# EAGLE design NDVI_pcb (EAGLE 9.6.2)
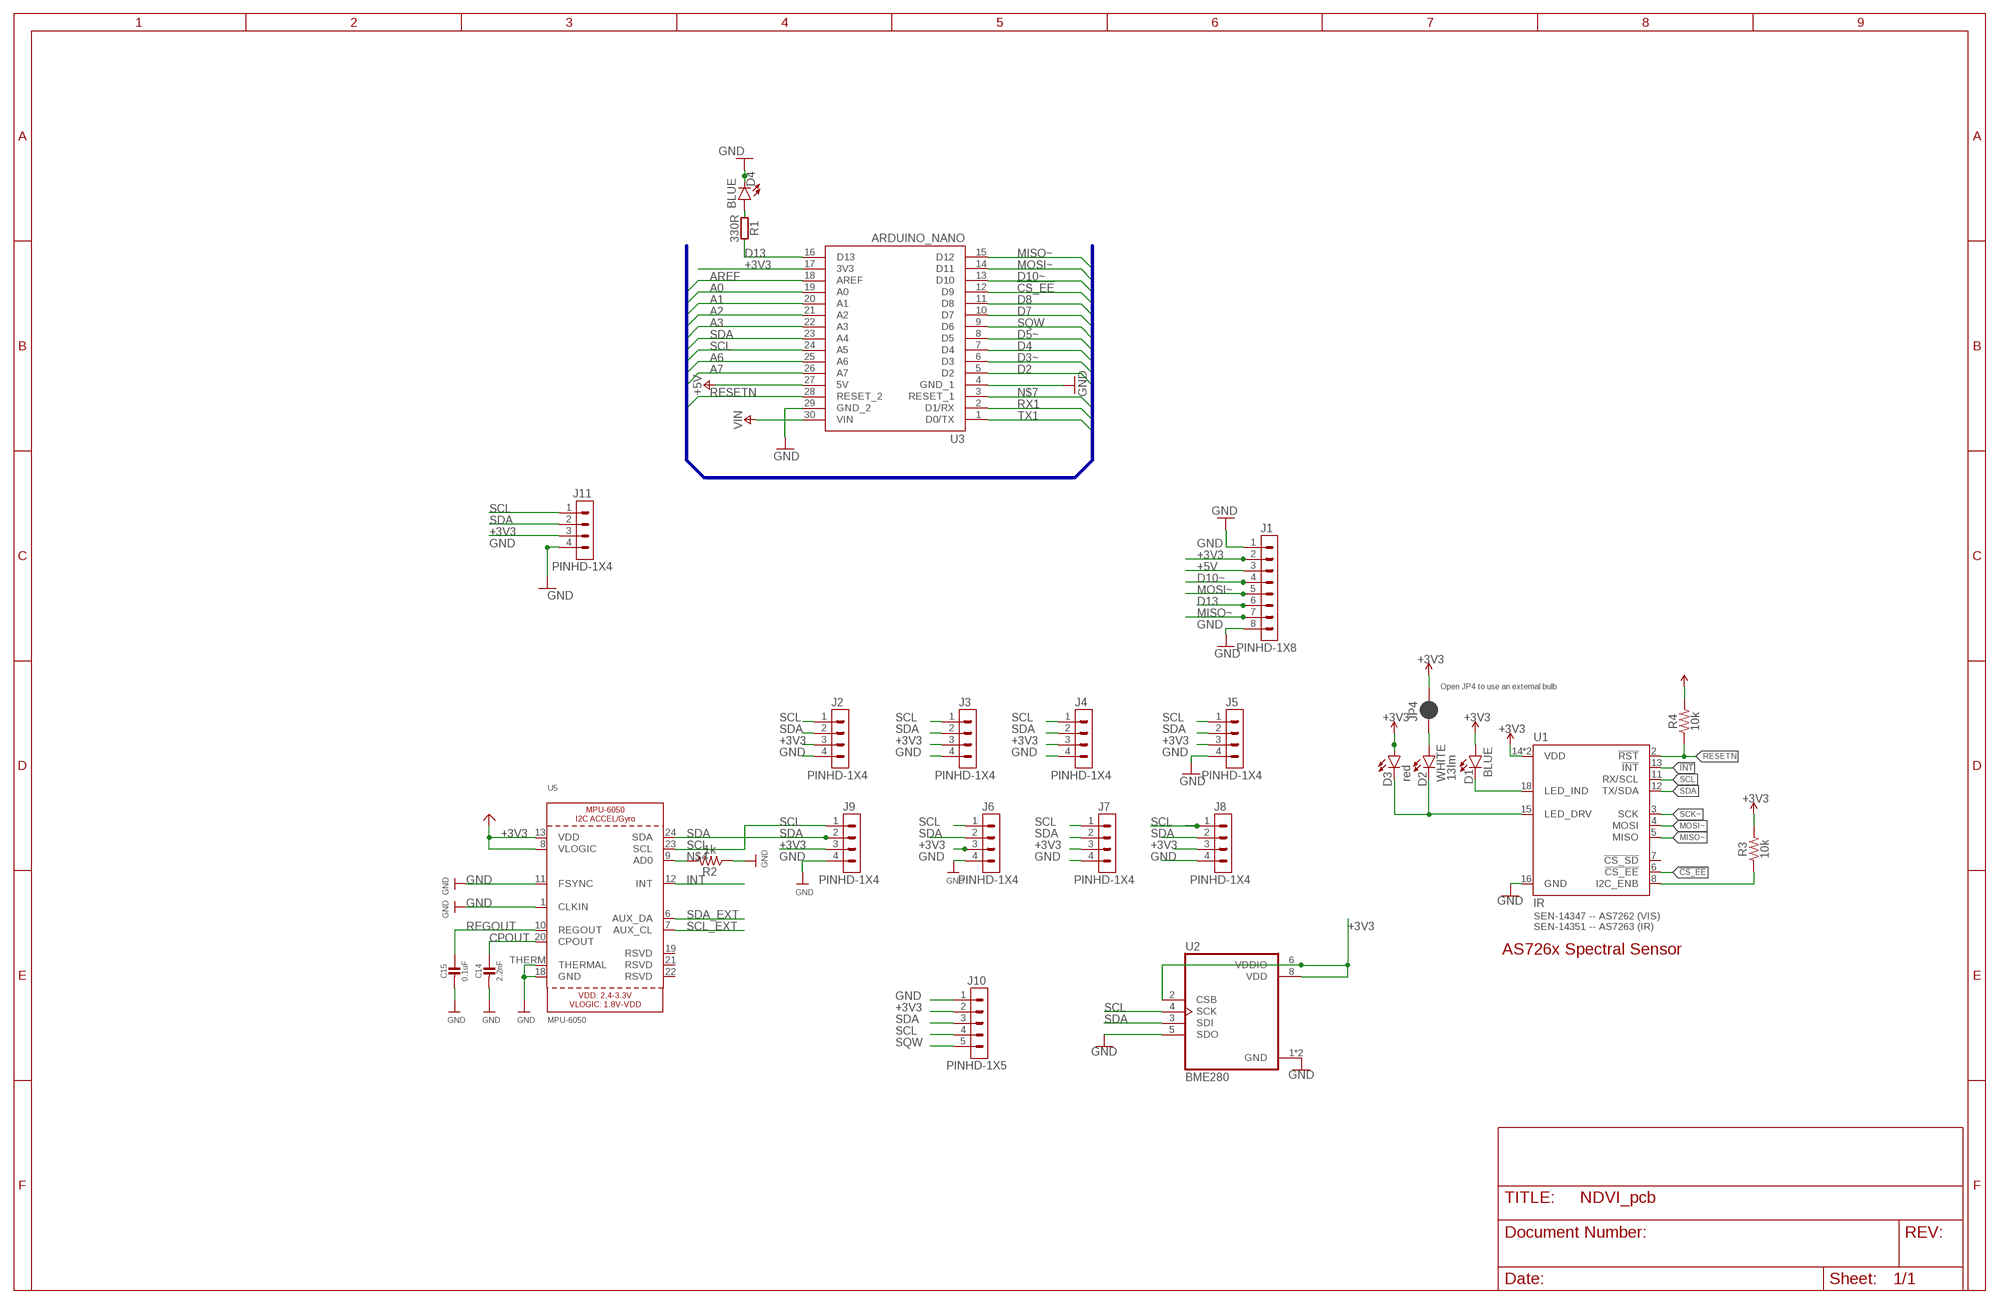
[diagram p0: schematic, sheet 1]

## Parts
C14  2.2nF  CAP_CERAMIC0603_NO  [0603-NO]
C15  0.1uF  CAP_CERAMIC0603_NO  [0603-NO]
D1  BLUE  LED-BLUE0603  [LED-0603]
D2  WHITE  LED-WHITE0603  [LED-0603]
D3  red  LED-WHITE0603  [LED-0603]
D4  BLUE  LED-BLUE0603  [LED-0603]
J1  PINHD-1X8  [1X08]
J2  PINHD-1X4  [1X04]
J3  PINHD-1X4  [1X04]
J4  PINHD-1X4  [1X04]
J5  PINHD-1X4  [1X04]
J6  PINHD-1X4  [1X04]
J7  PINHD-1X4  [1X04]
J8  PINHD-1X4  [1X04]
J9  PINHD-1X4  [1X04]
J10  PINHD-1X5  [1X05]
J11  PINHD-1X4  [1X04]
JP4  JUMPER-SMT_2_NC_PASTE_NO-SILK  [SMT-JUMPER_2_NC_PASTE_NO-SILK]
R1  330R  R-330R-0603  [C0603]
R2  1k  10KOHM-0603-1/10W-1%  [0603]
R3  10k  10KOHM-0603-1/10W-1%  [0603]
R4  10k  10KOHM-0603-1/10W-1%  [0603]
U1  IR  AS726XIR  [LGA20]
U2  BME280  [PSON65P250X250X100-8N]
U3  ARDUINO_NANO  ARDUINO_NANO_|_A000005  [MODULE_ARDUINO_NANO_|_A000005]
U5  MPU-6050  [QFN24_4MM_SMSC]

## Nets
!CS_EE: U1.6(!CS_EE) U3.12(D9)
!INT: U1.13(!INT)
+3V3: D1.A D3.A J1.2 J2.3 J3.3 J4.3 J5.3 J6.3 J7.3 J8.3 J9.3 J10.2 J11.3 JP4.2 R3.2 R4.2 U1.14(VDD) U1.17(VDD) U2.2(CSB) U2.6(VDDIO) U2.8(VDD) U3.17(3V3) U5.8(VLOGIC) U5.13(VDD) ; supply symbol labelled 3.3V
+5V: J1.3 U3.27(5V)
A0: U3.19(A0)
A1: U3.20(A1)
A2: U3.21(A2)
A3: U3.22(A3)
A6: U3.25(A6)
A7: U3.26(A7)
AREF: U3.18(AREF)
CPOUT: C14.1 U5.20(CPOUT)
D2: U3.5(D2)
D3~: U3.6(D3)
D4: U3.7(D4)
D5~: U3.8(D5)
D7: U3.10(D7)
D8: U3.11(D8)
D10~: J1.4 U3.13(D10)
D13: J1.6 R1.2 U3.16(D13)
GND: C14.2 C15.2 D4.C J1.1 J1.8 J2.4 J3.4 J4.4 J5.4 J6.4 J7.4 J8.4 J9.4 J10.1 J11.4 R2.1 U1.16(GND) U2.1(GND) U2.5(SDO) U2.7(GND) U3.29(GND_2) U5.1(CLKIN) U5.11(FSYNC) U5.18(GND) U5.THERM(THERMAL)
INT: U5.12(INT)
LED_DRV: D2.C D3.C U1.15(LED_DRV)
MISO~: J1.7 U1.5(MISO) U3.15(D12)
MOSI~: J1.5 U1.4(MOSI) U3.14(D11)
N$1: R3.1 U1.8(I2C_ENB)
N$2: D1.C U1.18(LED_IND)
N$3: D4.A R1.1
N$4: R2.2 U5.9(AD0)
N$5: U3.4(GND_1) ; supply symbol labelled GND
N$6: D2.A JP4.1
N$7: U3.3(RESET_1)
REGOUT: C15.1 U5.10(REGOUT)
RESETN: R4.1 U1.2(!RST) U3.28(RESET_2)
RX1: U3.2(D1/RX)
SCK~: U1.3(SCK)
SCL: J2.1 J3.1 J4.1 J5.1 J6.1 J7.1 J8.1 J9.1 J10.4 J11.1 U1.11(RX/SCL) U2.4(SCK) U3.24(A5) U5.23(SCL)
SCL_EXT: U5.7(AUX_CL)
SDA: J2.2 J3.2 J4.2 J5.2 J6.2 J7.2 J8.2 J9.2 J10.3 J11.2 U1.12(TX/SDA) U2.3(SDI) U3.23(A4) U5.24(SDA)
SDA_EXT: U5.6(AUX_DA)
SQW: J10.5 U3.9(D6)
TX1: U3.1(D0/TX)
VIN: U3.30(VIN)
Unconnected: U1.7(!CS_SD) U5.19(RSVD) U5.21(RSVD) U5.22(RSVD)

## Buses
A0,A1,A2,A3,A4/SDA,A5/SCL,A6,A7,AREF,D2,D3~,D4,D5~,D6~,D7,D8,D9~,D10~,MISO,MOSI,RESETN,RX0,RX1,SCK~,SCL,SDA,TX1,UPDI,VIN

## Notes on the sheet
- Open JP4 to use an external bulb
- 13lm
- SEN-14347 -- AS7262 (VIS)
  SEN-14351 -- AS7263 (IR)
- AS726x Spectral Sensor

## Library data of the parts
C14 C15 = microbuilder:CAP_CERAMIC: Ceramic Capacitors For new designs, use the packages preceded by an '_' character since they are more reliable: The following footprints should be used on most boards: _0402 - Standard footprint for regular board layouts _0603 - Standard footprint for regular board layouts _0805 - Standard footprint for regular board layouts _1206 - Standard footprint for regular board layouts For extremely tight-pitch boards where space is at a premium, the following 'micro-pitch' footprints can be used (smaller pads, no silkscreen outline, etc.): _0402MP - Micro-pitch footprint for very dense/compact boards _0603MP - Micro-pitch footprint for very dense/compact boards _0805MP - Micro-pitch footprint for very dense/compact boards _1206MP - Micro-pitch footprint for very dense/compact boards
D1 D4 = SparkFun-LED:LED-BLUE: Blue SMD LED Used in manufacturing of various products at SparkFun Packages: 0603 - SMD 0603 package [Product Link] <http://www.digikey.com/product-detail/en/SMLE12BC7TT86/511-1589-2-ND/1641808> 1206 - SMD1206 package [Product Link] <http://www.digikey.com/product-detail/en/lite-on-inc/LTST-C150TBKT/160-1643-1-ND/573584> SparkFun Products: ESP8266 Thing-Dev Board <https://www.sparkfun.com/products/13711> RedBoard <https://www.sparkfun.com/products/12757>; PROD_ID: DIO-08575
D2 = SparkFun-LED:LED-WHITE: White SMD LED Used in manufacturing several products at SparkFun. Packages: 0603 - Bright White SMD 0603 package[Product Link] <http://www.kingbrightusa.com/product.asp?catalog_name=LED&product_id=APT1608QWF/D> 1206 - Bright White SMD1206 package [Product Link] <http://www.kingbrightusa.com/product.asp?catalog_name=LED&product_id=APT3216QWF/D> 3014 - Super Bright SMD 3014 package [Datasheet] <http://www.lumileds.com/uploads/459/DS208-pdf> SparkFun Products: Blackberry Trackballer Breakout <https://www.sparkfun.com/products/13169> Digital SandBox <https://www.sparkfun.com/products/12651>; PROD_ID: DIO-09004
D3 = SparkFun-LED:LED-WHITE: White SMD LED Used in manufacturing several products at SparkFun. Packages: 0603 - Bright White SMD 0603 package[Product Link] <http://www.kingbrightusa.com/product.asp?catalog_name=LED&product_id=APT1608QWF/D> 1206 - Bright White SMD1206 package [Product Link] <http://www.kingbrightusa.com/product.asp?catalog_name=LED&product_id=APT3216QWF/D> 3014 - Super Bright SMD 3014 package [Datasheet] <http://www.lumileds.com/uploads/459/DS208-pdf> SparkFun Products: Blackberry Trackballer Breakout <https://www.sparkfun.com/products/13169> Digital SandBox <https://www.sparkfun.com/products/12651>; PROD_ID: DIO-09004; VALUE: WHITE
J1 = Connector:PINHD-1X8: Pin Header; CATEGORY: Connectors; DESCRIPTION: Header-Straight-8 Position; PACKAGE_TYPE: Through Hole; PITCH: 0.100" (2.54mm); SUBCATEGORY: Headers; TYPE: Male Pins
J2-J9 J11 = Connector:PINHD-1X4: Pin Header; CATEGORY: Connectors; DESCRIPTION: Header-Straight-4 Position; PACKAGE_TYPE: Through Hole; PITCH: 0.100" (2.54mm); SUBCATEGORY: Headers; TYPE: Male Pins
J10 = Connector:PINHD-1X5: Pin Header; CATEGORY: Connectors; DESCRIPTION: Header-Straight-5 Position; PACKAGE_TYPE: Through Hole; PITCH: 0.100" (2.54mm); SUBCATEGORY: Headers; TYPE: Male Pins
JP4 = SparkFun-Jumpers:JUMPER-SMT_2_NC_PASTE: Normally closed solder jumper This jumper has an aperture in the stencil to allow solder paste to bridge the split in the wire so it's normally closed (NC). Wick off the solder to open the connection. Reapply solder to reclose the connection.
R1 = Arduino-rcl:R: SMD Resistor; CODE-ARDUINO: 0049; DATASHEET: http://www.yageo.com/documents/recent/PYu-RC_Group_51_RoHS_L_10.pdf; DISTRIBUTOR-LINK: https://www.digikey.com/product-detail/en/yageo/RC0603FR-07330RL/311-330HRCT-ND/730109; DISTRIBUTOR-PN: 311-330HRCT-ND; MANUFACTURER: Yageo; MANUFACTURER-PN: RC0603FR-07330RL; NOTE: NO; PN-ALTERNATIVE1: -
R2 = SparkFun-Resistors:10KOHM: 10kΩ resistor A resistor is a passive two-terminal electrical component that implements electrical resistance as a circuit element. Resistors act to reduce current flow, and, at the same time, act to lower voltage levels within circuits. - Wikipedia; PROD_ID: RES-00824; VALUE: 10k
R3 R4 = SparkFun-Resistors:10KOHM: 10kΩ resistor A resistor is a passive two-terminal electrical component that implements electrical resistance as a circuit element. Resistors act to reduce current flow, and, at the same time, act to lower voltage levels within circuits. - Wikipedia; PROD_ID: RES-00824
U1 = SparkFun-Sensors:AS726X; PROD_ID: IC-13731
U2 = BME280:BME280: Check availability <https://pricing.snapeda.com/parts/BME280/Bosch/view-part?ref=eda>; AVAILABILITY: In Stock; CHECK_PRICES: https://www.snapeda.com/parts/BME280/Bosch/view-part/?ref=eda; DESCRIPTION: Board Mount Humidity Sensors MEMS humidity, pressure and temperature sensor; MF: Bosch; MP: BME280; PACKAGE: LGA-8 Bosch; PRICE: None; SNAPEDA_LINK: https://www.snapeda.com/parts/BME280/Bosch/view-part/?ref=snap
U3 = ARDUINO_NANO___A000005:ARDUINO_NANO_|_A000005: CLOCK SAW OSCILLATOR SEAM7050 T& Check availability <https://pricing.snapeda.com/parts/ARDUINO%20NANO%20%7C%20A000005/Arduino/view-part?ref=eda>; AVAILABILITY: Not in stock; CHECK_PRICES: https://www.snapeda.com/parts/ARDUINO%20NANO%20%7C%20A000005/Arduino/view-part/?ref=eda; DESCRIPTION: ATSAMD21G18A Arduino Nano 33 IoT series ARM® Cortex®-M0+ MCU 32-Bit Embedded Evaluation Board; MF: Arduino; MP: ARDUINO NANO | A000005; PACKAGE: Non-Standard Arduino; PRICE: None; PURCHASE-URL: https://www.snapeda.com/api/url_track_click_mouser/?unipart_id=7183667&manufacturer=Arduino&part_name=ARDUINO NANO | A000005&search_term=arduino nano; SNAPEDA_LINK: https://www.snapeda.com/parts/ARDUINO%20NANO%20%7C%20A000005/Arduino/view-part/?ref=snap
U5 = microbuilder:MPU-6050: MPU-6050 3-Axis Accelerometer/Gyroscope

## Net classes
1 highpower: width 0.406 mm, drill 0.483 mm

## Board
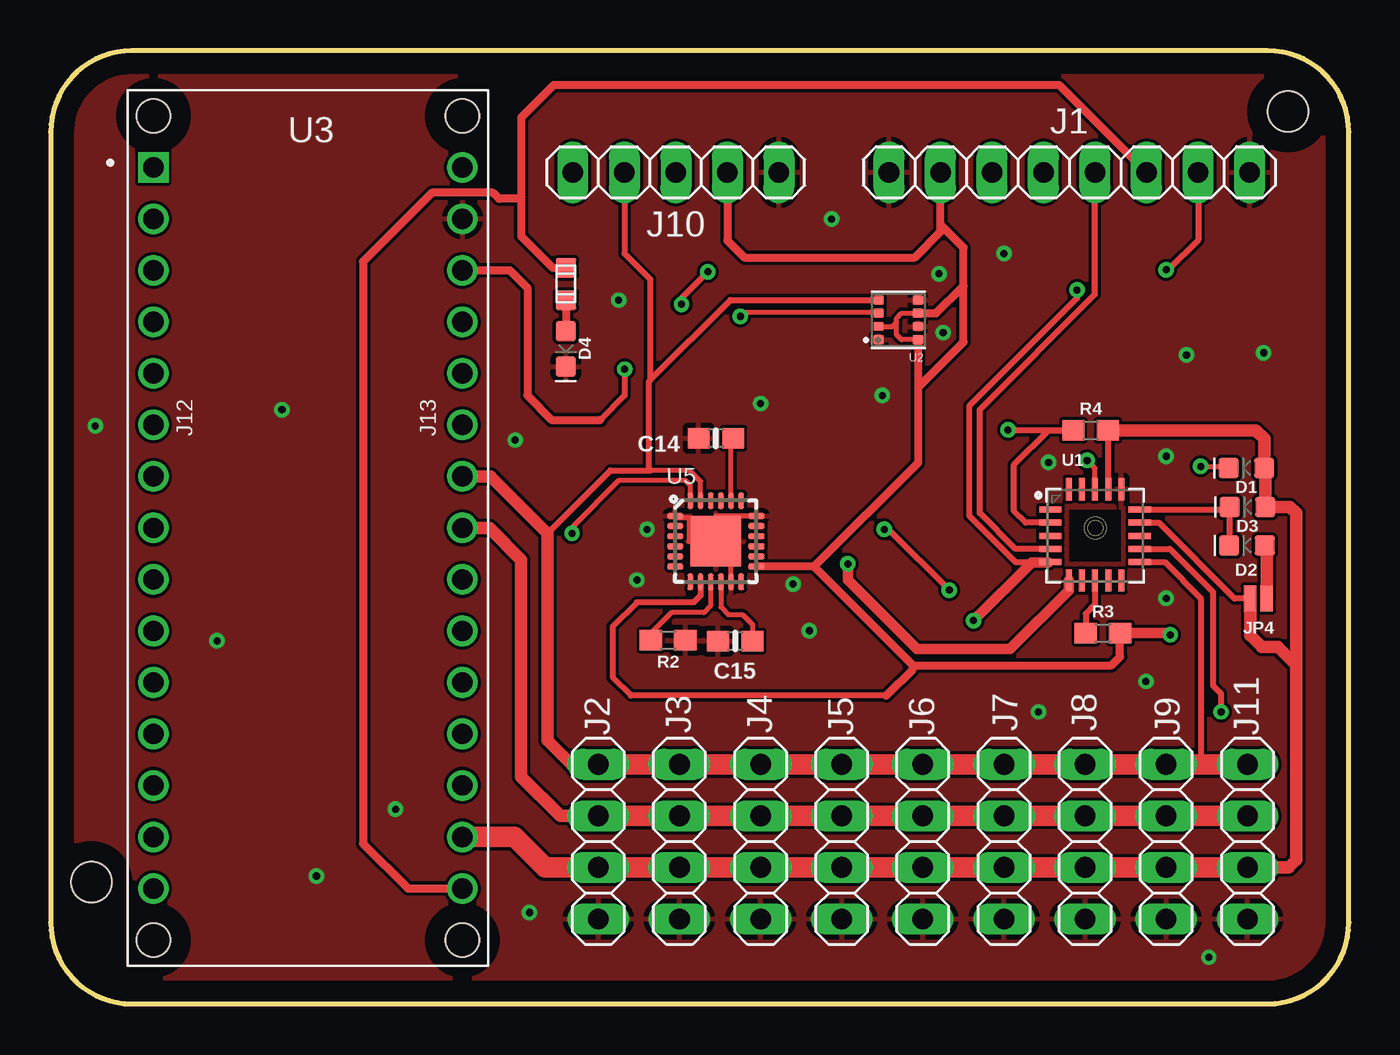
[diagram p1: board, top side]
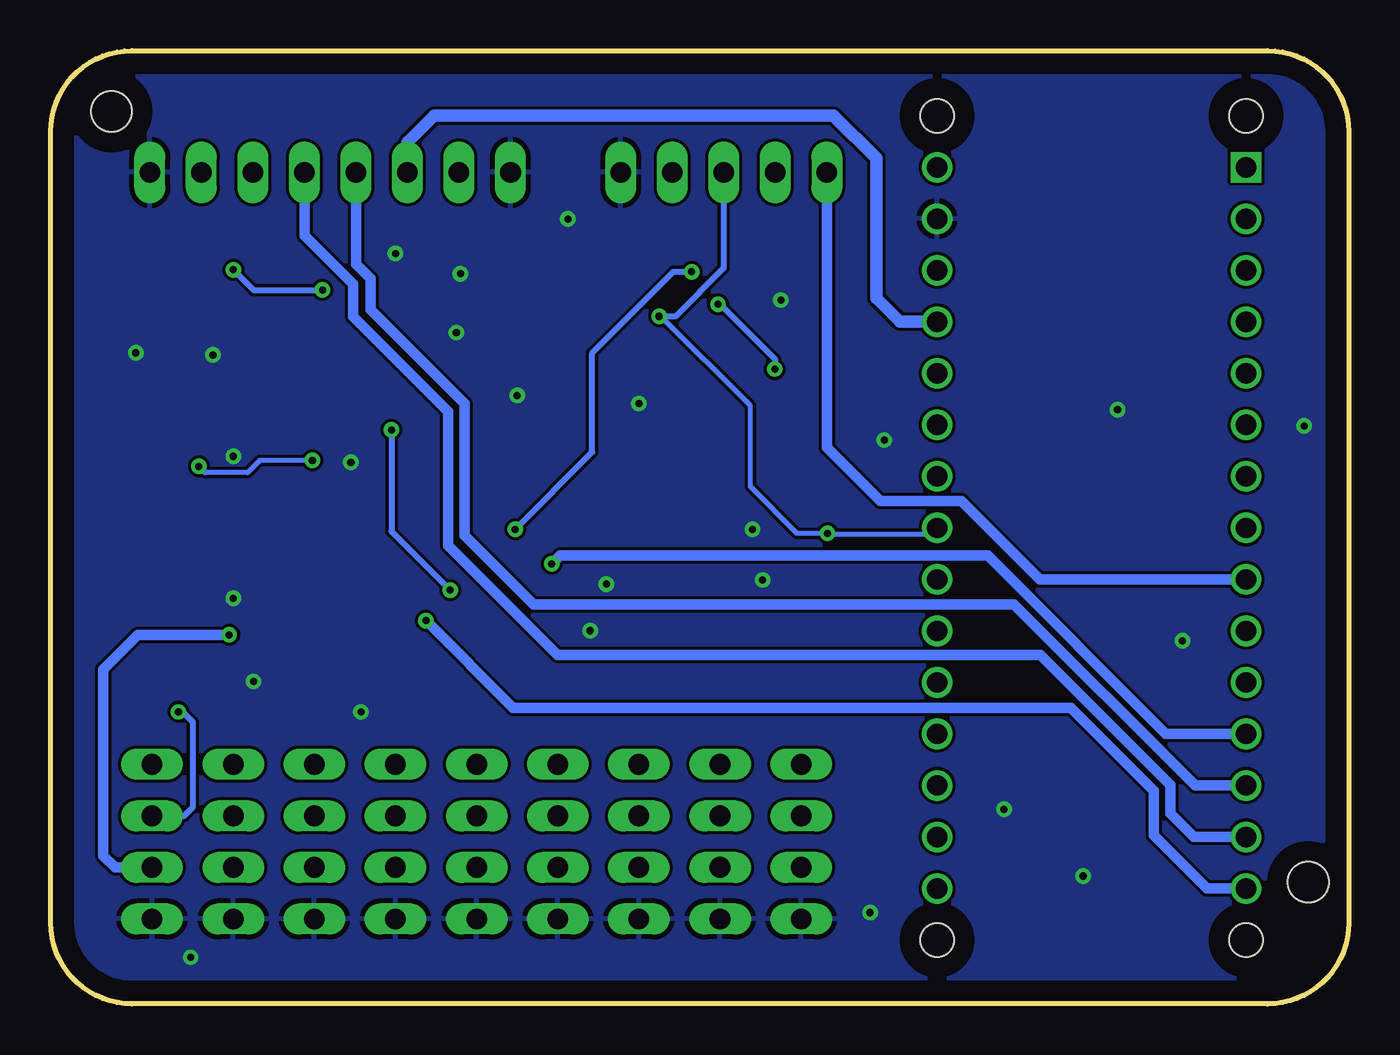
[diagram p2: board, bottom side, seen from below]

Size 64 x 47 mm. Coordinates in mm from the lower left corner, seen from the top.
Outline: 0,4 arc90 4,0 60,0 arc90 64,4 64,43 arc90 60,47 4,47 arc90 0,43 0,4
Copper layers (1*16): Top 0.035mm / dielectric 1.5mm / Bottom 0.035mm
Design rules "default": minimum track width 6mil, minimum drill 0.35mm, track to track 6mil, track to pad 6mil, pad to pad 6mil, via to via 6mil, smd to smd 6mil, copper to edge 40mil, drill to drill 6mil, minimum pad ring 10mil, minimum via ring 8mil, stop-mask expansion 4mil, vias tented up to drill 0mil, thermal gap 10mil
Holes 2 mm at 2,6 61,44

### Footprints (pad centres in the part's own frame; a part is rotated, then mirrored left to right if it is on the bottom)
0603-NO = smd 1.075 x 1: 1 -0.85,0; 2 0.85,0
LED-0603 = smd 1 x 1: A -0.877,0; C 0.877,0
1X08 = drill 1.016 long: 1 -8.89,0; 2 -6.35,0; 3 -3.81,0; 4 -1.27,0; 5 1.27,0; 6 3.81,0; 7 6.35,0; 8 8.89,0
1X04 = drill 1.016 long: 1 -3.81,0; 2 -1.27,0; 3 1.27,0; 4 3.81,0
1X05 = drill 1.016 long: 1 -5.08,0; 2 -2.54,0; 3 0,0; 4 2.54,0; 5 5.08,0
SMT-JUMPER_2_NC_PASTE_NO-SILK = smd 0.635 x 1.27: 1 -0.406,0; 2 0.406,0
C0603 = smd 0.95 x 1: 1 -0.8,0; 2 0.8,0
0603 = smd 1.1 x 1: 1 -0.85,0; 2 0.85,0
LGA20 = smd 1.1 x 0.3: 1 -2.2,1.3; 2 -2.2,0.65; 3 -2.2,0; 4 -2.2,-0.65; 5 -2.2,-1.3; 11 2.2,-1.3; 12 2.2,-0.65; 13 2.2,0; 14 2.2,0.65; 15 2.2,1.3 | smd 0.3 x 1.1: 6 -1.3,-2.2; 7 -0.65,-2.2; 8 0,-2.2; 9 0.65,-2.2; 10 1.3,-2.2; 16 1.3,2.3; 17 0.65,2.3; 18 0,2.3; 19 -0.65,2.3; 20 -1.3,2.3
PSON65P250X250X100-8N = smd 0.49 x 0.45: 1 0.97,0.975; 2 0.97,0.325; 3 0.97,-0.325; 4 0.97,-0.975; 5 -0.97,-0.975; 6 -0.97,-0.325; 7 -0.97,0.325; 8 -0.97,0.975
MODULE_ARDUINO_NANO_|_A000005 = drill 1 square: 1 -7.62,17.78 | drill 1: 2 -7.62,15.24; 3 -7.62,12.7; 4 -7.62,10.16; 5 -7.62,7.62; 6 -7.62,5.08; 7 -7.62,2.54; 8 -7.62,0; 9 -7.62,-2.54; 10 -7.62,-5.08; 11 -7.62,-7.62; 12 -7.62,-10.16; 13 -7.62,-12.7; 14 -7.62,-15.24; 15 -7.62,-17.78; 16 7.62,-17.78; 17 7.62,-15.24; 18 7.62,-12.7; 19 7.62,-10.16; 20 7.62,-7.62; 21 7.62,-5.08; 22 7.62,-2.54; 23 7.62,0; 24 7.62,2.54; 25 7.62,5.08; 26 7.62,7.62; 27 7.62,10.16; 28 7.62,12.7; 29 7.62,15.24; 30 7.62,17.78 | hole 1.651: -7.62,-20.32; 7.62,-20.32; -7.62,20.32; 7.62,20.32
QFN24_4MM_SMSC = smd 0.8 x 0.28: 1 -2,1.25; 2 -2,0.75; 3 -2,0.25; 4 -2,-0.25; 5 -2,-0.75; 6 -2,-1.25; 13 2,-1.25; 14 2,-0.75; 15 2,-0.25; 16 2,0.25; 17 2,0.75; 18 2,1.25 | smd 0.28 x 0.8: 7 -1.25,-2; 8 -0.75,-2; 9 -0.25,-2; 10 0.25,-2; 11 0.75,-2; 12 1.25,-2; 19 1.25,2; 20 0.75,2; 21 0.25,2; 22 -0.25,2; 23 -0.75,2; 24 -1.25,2 | smd 2.5 x 2.5: THERM 0,0

### Placement (x,y rotation side)
C14  32.8,27.89 180 top
C15  33.75,17.89 180 top
D1  58.95,26.42 180 top
D2  58.98,22.6 180 top
D3  59,24.5 180 top
D4  25.4,32.3 270 top
J1  50.22,41 0 top
J2  27,8 270 top
J3  31,8 270 top
J4  35,8 270 top
J5  39,8 270 top
J6  43,8 270 top
J7  47,8 270 top
J8  51,8 270 top
J9  55,8 270 top
J10  30.82,41 180 top
J11  59,8 270 top
JP4  59.54,19.99 180 top
R1  25.4,35.5 90 top
R2  30.44,17.93 180 top
R3  51.88,18.28 0 top
R4  51.27,28.28 0 top
U1  51.49,23.08 0 top
U2  41.79,33.73 180 top
U3  12.68,23.47 0 top
U5  32.79,22.81 0 top

### Tracks (layer width: path | path; a pad name or v marks a point on that pad's centre or on a via)
!CS_EE  (via drill 0.35)
  Top 0.508: v39.3,21.7 39.3,20.9 42.7,17.5 47.3,17.5 50.19,20.39 U1.6
  Bottom 0.508: U3.12 9.01,13.31 17.8,22.1 38.9,22.1 v39.3,21.7
+3V3  (via drill 0.35)
  Top 0.254: U2.2 41.51,33.41 41.7,33.6 | 41.7,33.6 41.7,33.8 41.95,34.05 U2.6 | U2.8 41.95,32.76 41.7,33 41.7,33.6
  Top 0.305: U1.14 54.63,23.73 58.37,19.99 JP4.2 | U1.17 52.14,28.26 R4.2 | 52.3,16.7 52.7,17.1 52.73,17.13 R3.2 | U5.8 32.04,20.14 31.7,19.8 28.9,19.8 27.7,18.6 27.7,16.1 28.6,15.2 41.2,15.2 | 42.5,16.7 42.5,16.6
  Top 0.406: U2.6 43.66,34.05 45,35.4 | 45,35.4 45,37.3 43.87,38.43 J1.2 43.87,38.07 42.6,36.8 34.2,36.8 33.36,37.64 J10.2 | U2.8 42.76,30.4 | 42.76,30.4 42.76,26.68 37.64,21.56 | 37.64,21.56 U5.13 | 37.64,21.56 42.5,16.7 52.3,16.7 52.73,17.13 | 52.7,17.1 52.7,18.25 R3.2 | 42.5,16.6 42.5,16.5 41.2,15.2 | 42.76,30.4 45,32.64 45,35.4
  Top 0.508: R3.2 55.12,18.28 v55.2,18.2
  Top 0.61: J11.3 61.03,6.73 61.4,7.1 61.4,16.7 | 61.4,16.7 60.5,17.6 59.7,17.6 59.13,18.17 JP4.2 | 61.4,16.7 61.4,24.2 61.1,24.5 D3.A 59.88,26.37 D1.A 59.83,27.87 59.42,28.28 R4.2
  Top 1.016: J11.3 J9.3 J8.3 J7.3 J6.3 J5.3 J4.3 J3.3 J2.3 24.37,6.73 22.87,8.23 U3.17
  Bottom 0.508: v55.2,18.2 59.7,18.2 61.4,16.5 61.4,7.3 60.83,6.73 J11.3
+5V
  Bottom 0.61: U3.27 22.13,33.63 23.3,34.8 23.3,41.7 25.4,43.8 45.1,43.8 46.41,42.49 J1.3
CPOUT
  Top 0.254: U5.20 33.54,27.78 C14.1
D10~
  Bottom 0.508: U3.13 7.57,10.77 16.5,19.7 40.2,19.7 43.6,23.1 43.6,29.6 48.24,34.24 48.24,35.77 48.95,36.48 J1.4
D13
  Top 0.406: J1.6 49.73,45.3 24.8,45.3 23.2,43.7 23.2,39.7 | R1.2 24.75,36.3 23.2,37.85 23.2,39.7 | 23.2,39.7 22.1,39.7 21.8,40 18.8,40 15.4,36.6 15.4,7.9 17.61,5.69 U3.16
GND  (via drill 0.35)
  Top 0.254: U5.11 33.54,22.81 U5.THERM 31.47,22.81 31.47,23.98 30.79,23.98 U5.1 | U5.18 32.8,24.06 32.8,23.2
  other vias: 56,32 41,30 47,37 55,27 55,20 49.2,26.7 59.8,32.1 54,15.9 35,29.6 37.4,18.4 36.6,20.7 28.9,20.9 29.4,23.4 22.9,27.8 28,34.7 38.5,38.7 11.4,29.3 8.2,17.9 2.2,28.5 13.1,6.3 17,9.6 23.6,4.5 57.1,2.3 48.7,14.4 43.8,36 44,33.1
  pour Top: 0,47 64,47 64,0 0,0
  pour Bottom: 0,47 0,0 64,0 64,47
LED_DRV
  Top 0.305: U1.15 58,24.38 D3.C 58.1,24.48 D2.C
MISO~  (via drill 0.35)
  Top 0.305: U1.5 49.2,21.77 47.58,21.77 45.3,24.05 45.3,29.5 50.6,34.8 v50.6,35.2 | J1.7 56.57,37.67 55.1,36.2 v55,36.2
  Top 0.508: v45.5,18.9 48.37,21.77 49.2,21.77
  Bottom 0.305: v55,36.2 54,35.2 v50.6,35.2
  Bottom 0.508: U3.15 6.99,5.69 9.6,8.3 9.6,10.5 13.7,14.6 41.2,14.6 v45.5,18.9
MOSI~
  Top 0.305: U1.4 47.57,22.43 45.8,24.2 45.8,29.3 51.49,34.99 J1.5
  Bottom 0.508: U3.14 7.63,8.23 8.8,9.4 8.8,10.8 15.2,17.2 39,17.2 44.4,22.6 44.4,29.2 49.1,33.9 49.1,35.5 51.49,37.89 J1.5
N$1
  Top 0.305: U1.8 51.49,19.69 51.03,19.23 R3.1
N$2  (via drill 0.35)
  Top 0.254: U1.18 51.49,26.41 v51.1,26.8 | v56.7,26.5 57.99,26.5 D1.C
  Bottom 0.254: v51.1,26.8 53.7,26.8 54.3,26.2 56.4,26.2 v56.7,26.5
N$3
  Top 0.406: R1.1 D4.A
N$4
  Top 0.254: U5.9 32.54,19.64 32.2,19.3 30.6,19.3 29.59,18.29 R2.2
N$6
  Top 0.61: D2.A 59.95,22.51 JP4.1
REGOUT
  Top 0.254: U5.10 33.04,19.56 33.4,19.2 34.1,19.2 34.6,18.7 C15.1
RESETN  (via drill 0.35)
  Top 0.305: U1.2 48.07,23.73 47.5,24.3 47.5,26.6 49.18,28.28 R4.1 47.22,28.28 v47.2,28.3 | v44.3,20.4 41.3,23.4 v41.1,23.4 | v32.4,36.1 30.95,34.65 v31.1,34.5 | v28.3,31.3 28.3,30 27.1,28.8
  Top 0.406: U3.28 22.63,36.17 23.5,35.3 23.5,30 24.7,28.8 27.1,28.8
  Bottom 0.305: v47.2,28.3 47.2,23.3 v44.3,20.4 | v41.1,23.4 37.3,27.2 37.3,32.1 33.3,36.1 v32.4,36.1 | v31.1,34.5 31,34.5 28.3,31.8 v28.3,31.3
SCL
  Top 0.254: U5.23 32.04,25.76 31.5,26.3 29.6,26.3
  Top 0.305: J10.4 28.28,37 29.55,35.73 29.55,30.75 | 24.5,23.2 27.6,26.3 29.5,26.3 | 29.5,26.3 29.6,26.3 | 29.5,26.3 29.5,30.7 29.55,30.75 | 29.55,30.75 33.51,34.7 U2.4 | U1.11 54.92,21.78 56.7,20 56.7,11.81
  Top 0.61: U3.24 21.69,26.01 24.5,23.2 24.5,13 25.69,11.81 J2.1
  Top 1.016: J2.1 J3.1 J4.1 J5.1 J6.1 J7.1 J8.1 J9.1 56.7,11.81 J11.1
SDA  (via drill 0.35)
  Top 0.254: U5.24 31.54,25.56 31.3,25.8 28,25.8 25.7,23.5 v25.7,23.2 | v34,33.9 34.2,34.1 40.77,34.1 U2.3
  Top 0.305: U1.12 55.17,22.43 57.3,20.3 57.3,15.7 57.7,15.3 v57.7,14.4
  Top 0.61: U3.23 21.63,23.47 23.2,21.9 23.2,11.2 25.13,9.27 J2.2
  Top 1.016: J11.2 J9.2 J8.2 J7.2 J6.2 J5.2 J4.2 J3.2 J2.2
  Bottom 0.254: U3.23 20.6,23.17 25.53,23.17 25.56,23.2 v25.7,23.2 27.2,23.2 29.5,25.5 29.5,29.5 33.9,33.9 v34,33.9
  Bottom 0.305: J10.3 30.82,36.28 33.2,33.9 v34,33.9 | v57.7,14.4 57.5,14.4 57,13.9 57,9.7 57.43,9.27 J11.2
SQW
  Bottom 0.508: U3.9 15.23,20.93 19.1,24.8 23.1,24.8 25.74,27.44 J10.5

### Text on the board
tNames: J12 | J13